# Altium schematic sheet Rotary_Encoder.SchDoc: ZStation Rotary Encoder
size A4; Engineer: Stephan Eersels; DocumentNumber: 12202925_ZS; Revision: 2.1; SheetNumber: 6; SheetTotal: 8
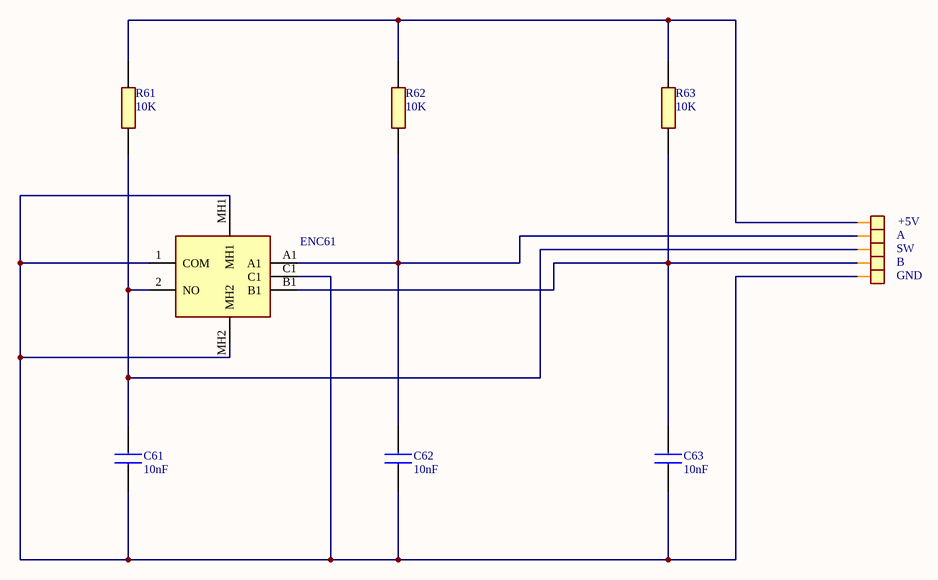
[diagram p0: Rotary_Encoder.SchDoc]

## Parts
C61  10nF  [C315C103K5R5TA7303]
C62  10nF  [C315C103K5R5TA7303]
C63  10nF  [C315C103K5R5TA7303]
ENC61  ROTARY&SWITCH  [PEC11R4225FS0012]  (value not drawn)
H61  +5V  [Header_M_S]
H62  A  [Header_M_S]
H63  SW  [Header_M_S]
H64  B  [Header_M_S]
H65  GND  [Header_M_S]
R61  10K  [VISHAY_CMF_60]
R62  10K  [VISHAY_CMF_60]
R63  10K  [VISHAY_CMF_60]

## Nets
NetC61_1: C61.1 C62.1 C63.1 ENC61.1(COM) ENC61.C1 ENC61.MH1 ENC61.MH2 H65.H?(HF)
NetC61_2: C61.2 ENC61.2(NO) H63.H?(HF) R61.1
NetC62_2: C62.2 ENC61.A1 H62.H?(HF) R62.1
NetC63_2: C63.2 ENC61.B1 H64.H?(HF) R63.1
NetH61_H?: H61.H?(HF) R61.2 R62.2 R63.2

## Library data of the parts
C61-C63 = C315C103K5R5TA7303: GoldMax 300 Comm X7R, Ceramic, 0.01 uF, 10%, 50 VDC, 125 VDC, 125C, -55C, X7R, GoldMax, Commercial Standard, 2.5 % , 100 GOhms, 3.81mm, 3.14mm, 2.54mm, Lead Spacing = 2.54mm, 18mm, 0.51mm, 2500, 80; Manufacturer_Name: KEMET; Geometry.Height: 4.66mm; Mouser Part Number: 80-C315C103K5R-TR; Mouser Price/Stock: https://www.mouser.co.uk/ProductDetail/KEMET/C315C103K5R5TA7303?qs=LJ1pyEEo5rYBfSJP9%252BZ%252BkA%3D%3D; Manufacturer_Part_Number: C315C103K5R5TA7303; Datasheet Link: https://content.kemet.com/datasheets/KEM_C1050_GOLDMAX_X7R.pdf
ENC61 = ROTARY: Encoder 20mm SHAFT w/SWITCH; Manufacturer_Name: Bourns; Manufacturer_Part_Number: PEC11R-4225F-S0012; Datasheet Link: https://www.bourns.com/docs/product-datasheets/pec11r.pdf?sfvrsn=bb617cbf_11; Height: 31.5mm; Mouser Part Number: 652-PEC11R-4225F-S12; Mouser Price/Stock: https://www.mouser.co.uk/ProductDetail/Bourns/PEC11R-4225F-S0012?qs=Zq5ylnUbLm4jMN%252BFiPmzDg%3D%3D
H61-H65 = Head_M_S
R61-R63 = RES_68K_10K: Through Hole 1W 10/68 Kohms 1%; Manufacturer_Name: Vishay; Manufacturer_Part_Number: CMF6010K000FKEB; Datasheet Link: https://datasheet.datasheetarchive.com/originals/distributors/Datasheets-DGA8/3123891.pdf; Mouser Part Number: 71-CMF6010K000FKEB; Mouser Price/Stock: https://www.mouser.co.uk/ProductDetail/Vishay-Dale/CMF6010K000FKEB?qs=GEEnpASSx%2Fgpk8SPxIuFzw%3D%3D; Arrow Part Number: CMF6010K000FKEB; Arrow Price/Stock: https://www.arrow.com/en/products/cmf6010k000fkeb/vishay